# Altium schematic sheet TV.SchDoc
size A4
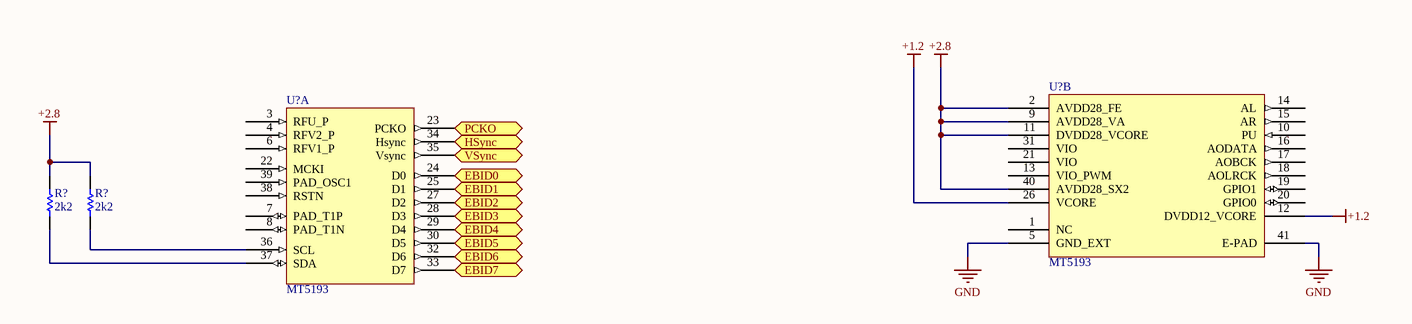
[diagram p0: TV.SchDoc]

## Parts
(Parts that share a designator on the sheet are numbered #1, #2 ... from top to bottom, then left to right.)
R?#1  2k2  [3-0603]
R?#2  2k2  [3-0603]
U?#1  MT5193  [QFN5x5 40PIN]  (part B of 2)
U?#2  MT5193  [QFN5x5 40PIN]  (part A of 2)

## Ports
EBID0, EBID1, EBID2, EBID3, EBID4, EBID5, EBID6, EBID7, HSync, PCKO, VSync

## Nets
+1.2: U?#1.12(DVDD12_VCORE) U?#1.26(VCORE)
+2.8: R?#1.2 R?#2.2 U?#1.2(AVDD28_FE) U?#1.9(AVDD28_VA) U?#1.11(DVDD28_VCORE) U?#1.40(AVDD28_SX2)
GND: U?#1.5(GND_EXT) U?#1.41(E-PAD)
EBID0: U?#2.24(D0) ; port EBID0
EBID1: U?#2.25(D1) ; port EBID1
EBID2: U?#2.27(D2) ; port EBID2
EBID3: U?#2.28(D3) ; port EBID3
EBID4: U?#2.29(D4) ; port EBID4
EBID5: U?#2.30(D5) ; port EBID5
EBID6: U?#2.32(D6) ; port EBID6
EBID7: U?#2.33(D7) ; port EBID7
HSync: U?#2.34(Hsync) ; port HSync
PCKO: U?#2.23(PCKO) ; port PCKO
VSync: U?#2.35(Vsync) ; port VSync
NetR?#1_1: R?#1.1 U?#2.37(SDA)
NetR?#2_1: R?#2.1 U?#2.36(SCL)

Not connected (* = marked no-connect by the designer): U?#1 1(NC) 10(PU) 13(VIO_PWM) 14(AL) 15(AR) 16(AODATA) 17(AOBCK) 18(AOLRCK) 19(GPIO1) 20(GPIO0) 21(VIO) 31(VIO); U?#2 3(RFU_P) 4(RFV2_P) 6(RFV1_P) 7(PAD_T1P) 8(PAD_T1N) 22(MCKI) 38(RSTN) 39(PAD_OSC1)

## Library data of the parts
R?#1 R?#2 = ERJ3RE: Precision Thick Film Chip Resistor, 10 Ohm to 1M Ohm Range, 1% and 0.5% Tolerance, 0603 Size, 0.063 W; Published: 17-Dec-2003; LatestRevisionDate: 19-Mar-2004; LatestRevisionNote: Silkscreen size reduced.; PackageDocument: Mar-2003; PackageReference: 3-0603; Publisher: Altium Limited; Code_IPC: 1608 [0603]; ComponentLink1Description: Manufacturer Link; ComponentLink1URL: http://www.panasonic.com/industrial/components/resistive_products.htm; ComponentLink2Description: Datasheet; ComponentLink2URL: http://www.panasonic.com/industrial/components/pdf/AOA0000CE2.pdf
U?#1 U?#2 = MT5193: Mobile Analogic TV Receiver SOC